# EasyEDA schematic SCH_16pady.json
TITLE: Sheet_1; REV: 1.0; Date: 2023-12-22; Sheet: 1/1; Drawn By: glooper; Company: Your Company
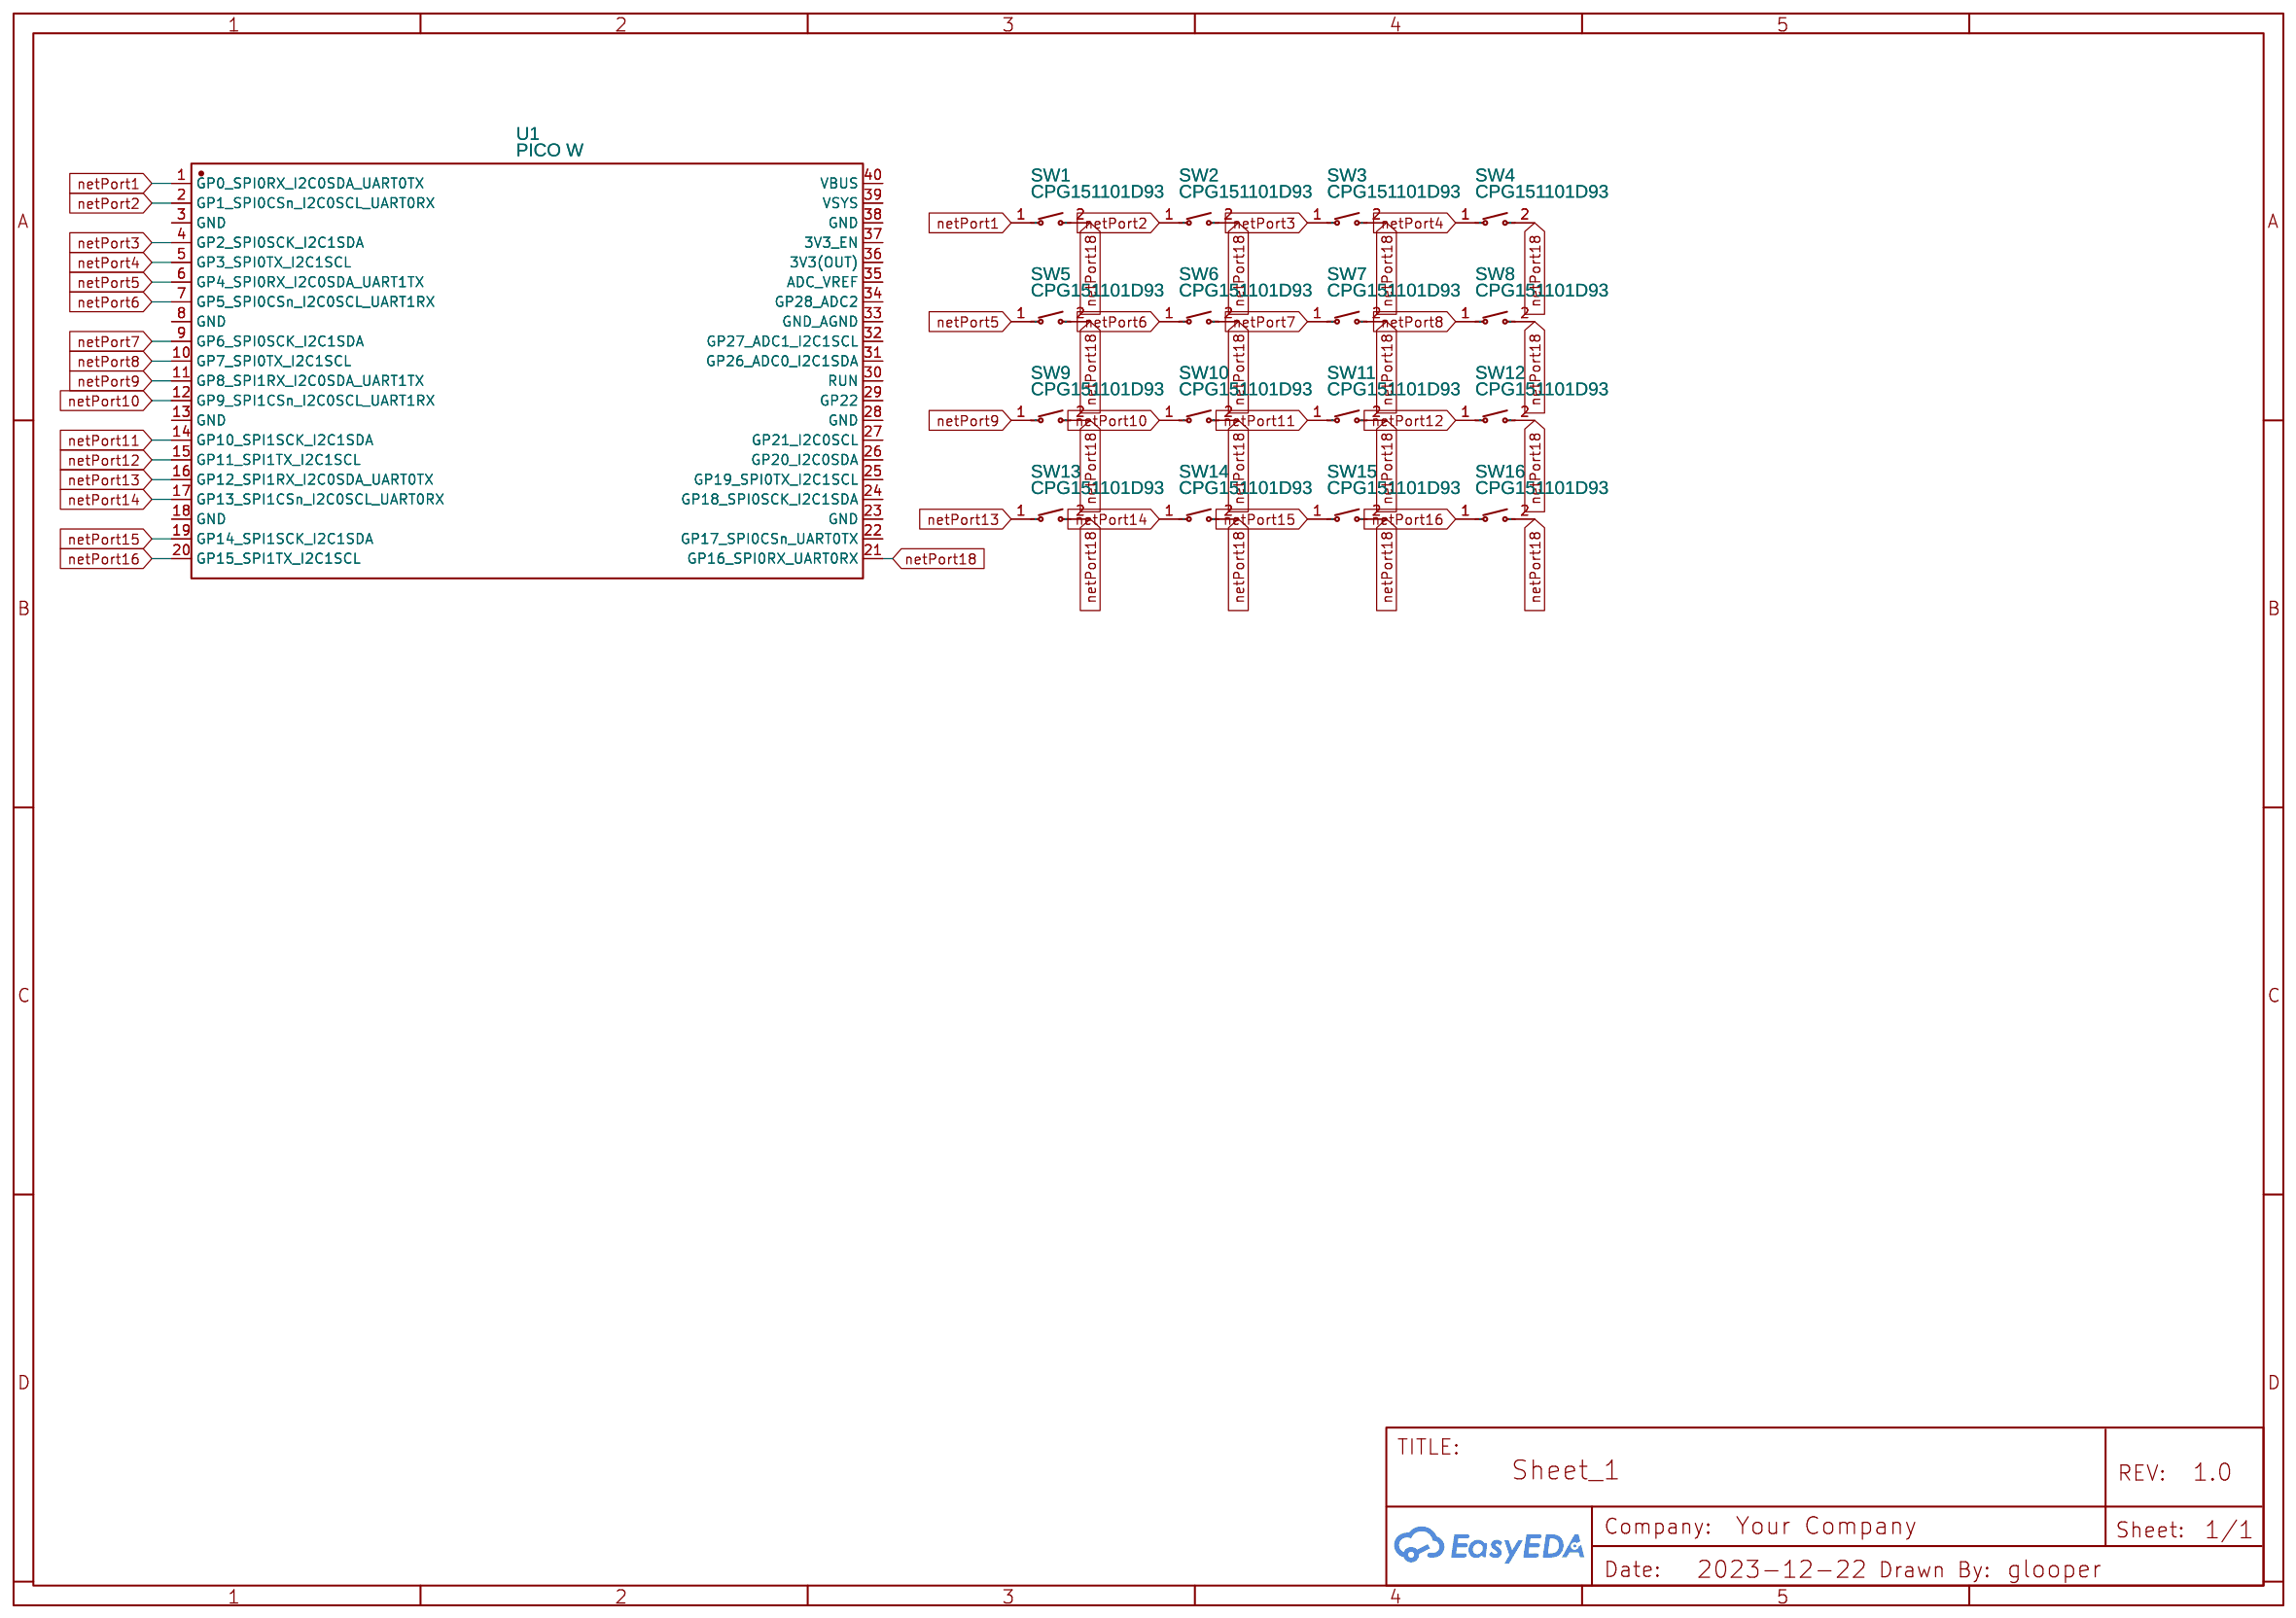
[diagram p0: schematic sheet]

## Parts
SW1  CPG151101D93  [SW-TH_CPG151101D9X]
SW2  CPG151101D93  [SW-TH_CPG151101D9X]
SW3  CPG151101D93  [SW-TH_CPG151101D9X]
SW4  CPG151101D93  [SW-TH_CPG151101D9X]
SW5  CPG151101D93  [SW-TH_CPG151101D9X]
SW6  CPG151101D93  [SW-TH_CPG151101D9X]
SW7  CPG151101D93  [SW-TH_CPG151101D9X]
SW8  CPG151101D93  [SW-TH_CPG151101D9X]
SW9  CPG151101D93  [SW-TH_CPG151101D9X]
SW10  CPG151101D93  [SW-TH_CPG151101D9X]
SW11  CPG151101D93  [SW-TH_CPG151101D9X]
SW12  CPG151101D93  [SW-TH_CPG151101D9X]
SW13  CPG151101D93  [SW-TH_CPG151101D9X]
SW14  CPG151101D93  [SW-TH_CPG151101D9X]
SW15  CPG151101D93  [SW-TH_CPG151101D9X]
SW16  CPG151101D93  [SW-TH_CPG151101D9X]
U1  PICO W  [LCC-40_L51.0-W21.0-P2.54-BL_RP2040-BASED]

## Library data of the parts
SW1-SW16 = CPG151101D93: Contributor: LCSC; Supplier: LCSC; Supplier Part: C400237; Manufacturer: Kailh(凯华); JLCPCB Part Class: Extended Part
U1 = PICO W: Supplier: LCSC; Supplier Part: C7203003; Manufacturer: Raspberry Pi(树莓派); Contributor: lcsc; JLCPCB Part Class: Extended Part

## Nets
netPort1: SW1.1 U1.1(GP0_SPI0RX_I2C0SDA_UART0TX)
netPort2: SW2.1 U1.2(GP1_SPI0CSn_I2C0SCL_UART0RX)
netPort3: SW3.1 U1.4(GP2_SPI0SCK_I2C1SDA)
netPort4: SW4.1 U1.5(GP3_SPI0TX_I2C1SCL)
netPort5: SW5.1 U1.6(GP4_SPI0RX_I2C0SDA_UART1TX)
netPort6: SW6.1 U1.7(GP5_SPI0CSn_I2C0SCL_UART1RX)
netPort7: SW7.1 U1.9(GP6_SPI0SCK_I2C1SDA)
netPort8: SW8.1 U1.10(GP7_SPI0TX_I2C1SCL)
netPort9: SW9.1 U1.11(GP8_SPI1RX_I2C0SDA_UART1TX)
netPort10: SW10.1 U1.12(GP9_SPI1CSn_I2C0SCL_UART1RX)
netPort11: SW11.1 U1.14(GP10_SPI1SCK_I2C1SDA)
netPort12: SW12.1 U1.15(GP11_SPI1TX_I2C1SCL)
netPort13: SW13.1 U1.16(GP12_SPI1RX_I2C0SDA_UART0TX)
netPort14: SW14.1 U1.17(GP13_SPI1CSn_I2C0SCL_UART0RX)
netPort15: SW15.1 U1.19(GP14_SPI1SCK_I2C1SDA)
netPort16: SW16.1 U1.20(GP15_SPI1TX_I2C1SCL)
netPort18: SW1.2 SW2.2 SW3.2 SW4.2 SW5.2 SW6.2 SW7.2 SW8.2 SW9.2 SW10.2 SW11.2 SW12.2 SW13.2 SW14.2 SW15.2 SW16.2 U1.21(GP16_SPI0RX_UART0RX)

Not connected (* = marked no-connect by the designer): U1 3(GND) 8(GND) 13(GND) 18(GND) 22(GP17_SPI0CSn_UART0TX) 23(GND) 24(GP18_SPI0SCK_I2C1SDA) 25(GP19_SPI0TX_I2C1SCL) 26(GP20_I2C0SDA) 27(GP21_I2C0SCL) 28(GND) 29(GP22) 30(RUN) 31(GP26_ADC0_I2C1SDA) 32(GP27_ADC1_I2C1SCL) 33(GND_AGND) 34(GP28_ADC2) 35(ADC_VREF) 36(3V3(OUT)) 37(3V3_EN) 38(GND) 39(VSYS) 40(VBUS)
